# EAGLE schematic 3x7seg-driver (EAGLE 6.5.0)
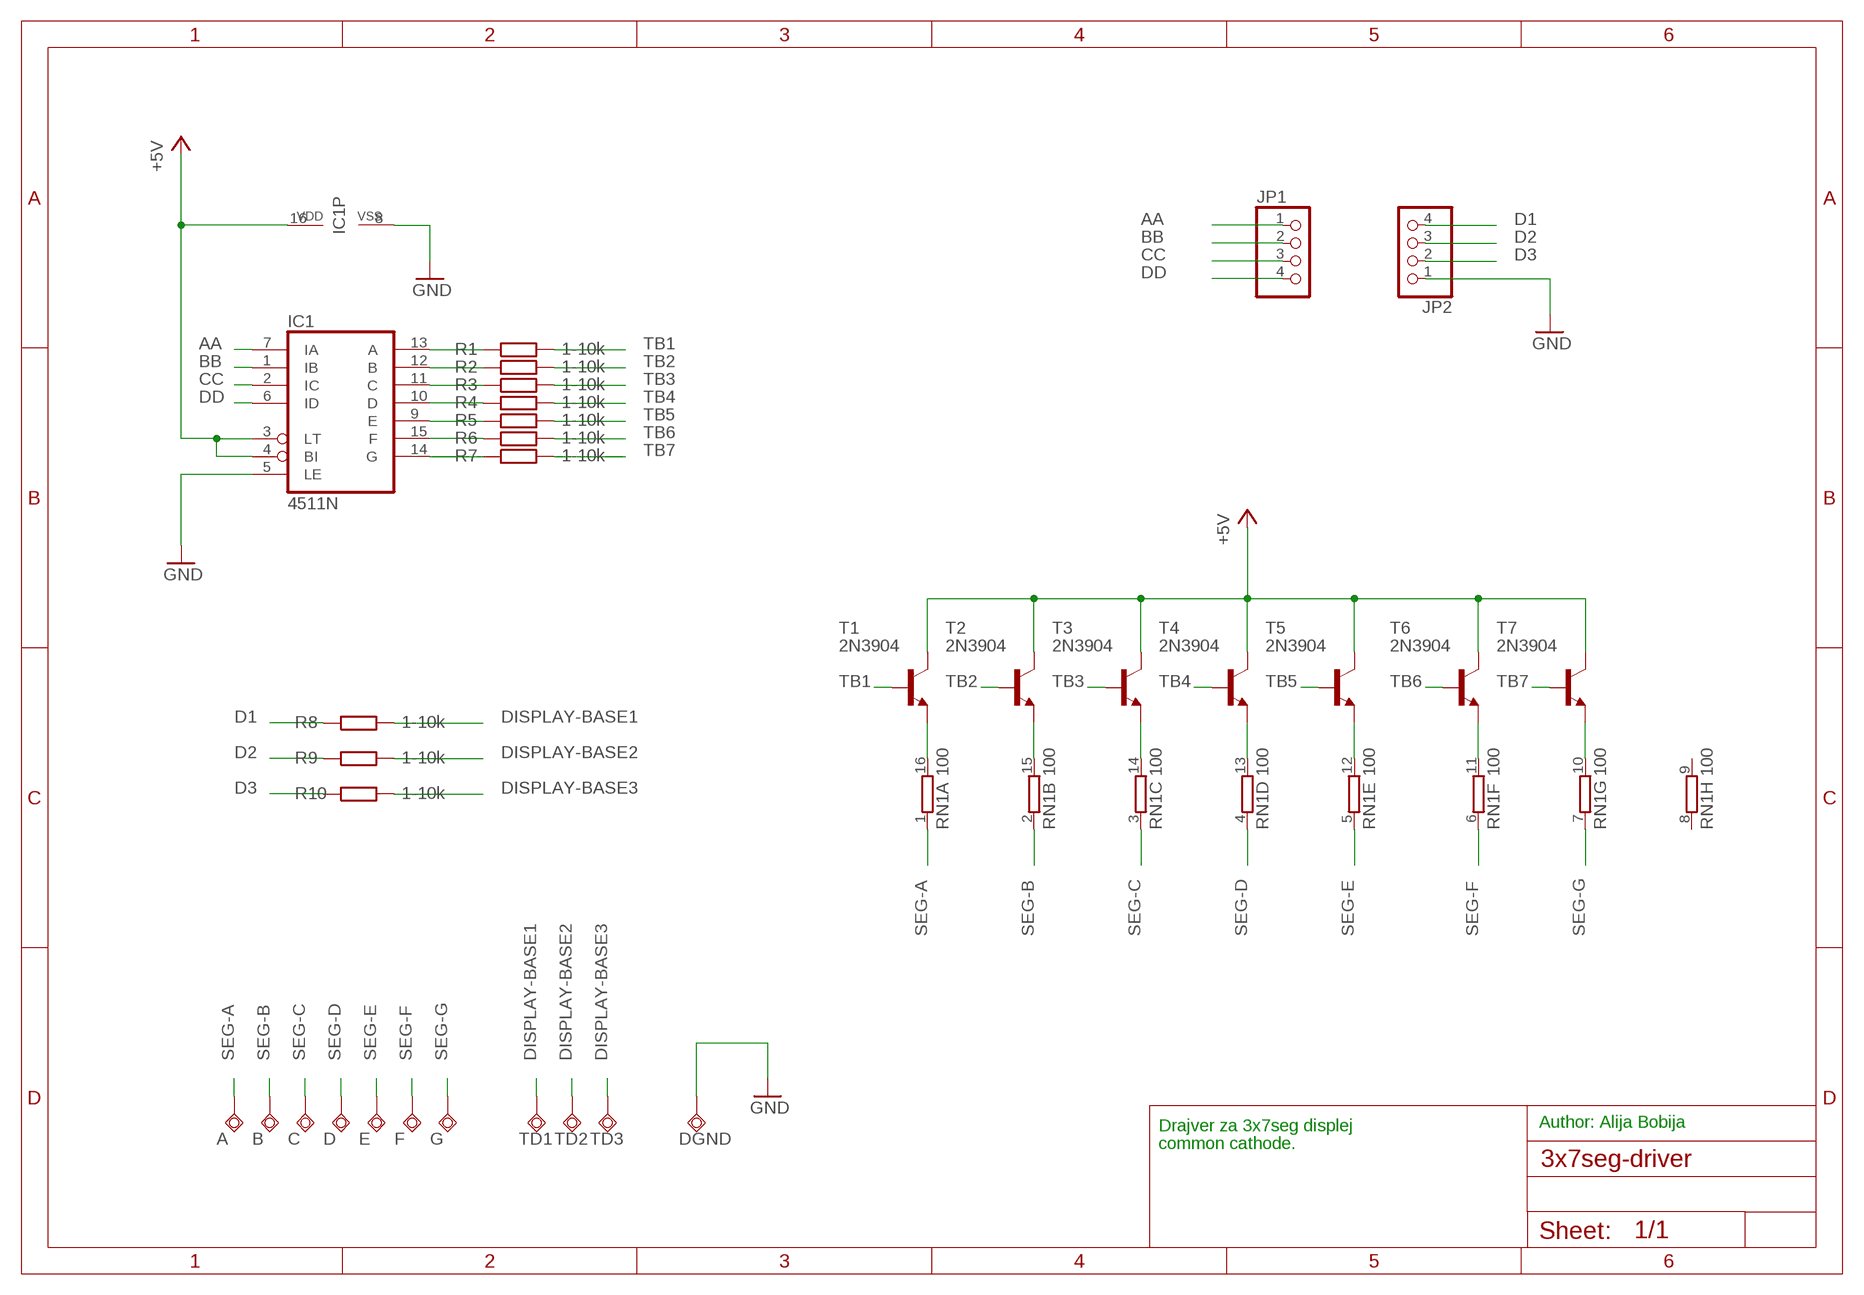
[diagram p0: schematic, sheet 1]

## Parts
A  TPSQTP20SQ  [TP20SQ]
B  TPSQTP20SQ  [TP20SQ]
C  TPSQTP20SQ  [TP20SQ]
D  TPSQTP20SQ  [TP20SQ]
DGND  TPSQTP20SQ  [TP20SQ]
E  TPSQTP20SQ  [TP20SQ]
F  TPSQTP20SQ  [TP20SQ]
G  TPSQTP20SQ  [TP20SQ]
IC1  4511N  [DIL16]
JP1  PINHD-1X4/90  [1X04/90]
JP2  PINHD-1X4/90  [1X04/90]
R1  1-10k  R-EU_0207/7  [0207/7]
R2  1-10k  R-EU_0207/7  [0207/7]
R3  1-10k  R-EU_0207/7  [0207/7]
R4  1-10k  R-EU_0207/7  [0207/7]
R5  1-10k  R-EU_0207/7  [0207/7]
R6  1-10k  R-EU_0207/7  [0207/7]
R7  1-10k  R-EU_0207/7  [0207/7]
R8  1-10k  R-EU_0207/7  [0207/7]
R9  1-10k  R-EU_0207/7  [0207/7]
R10  1-10k  R-EU_0207/7  [0207/7]
RN1  100  8R-N  [DIL16]
T1  2N3904  -NPN-SOT23-EBC  [SOT23-EBC]
T2  2N3904  -NPN-SOT23-EBC  [SOT23-EBC]
T3  2N3904  -NPN-SOT23-EBC  [SOT23-EBC]
T4  2N3904  -NPN-SOT23-EBC  [SOT23-EBC]
T5  2N3904  -NPN-SOT23-EBC  [SOT23-EBC]
T6  2N3904  -NPN-SOT23-EBC  [SOT23-EBC]
T7  2N3904  -NPN-SOT23-EBC  [SOT23-EBC]
TD1  TPSQTP20SQ  [TP20SQ]
TD2  TPSQTP20SQ  [TP20SQ]
TD3  TPSQTP20SQ  [TP20SQ]

## Nets
+5V: IC1.3(LT) IC1.4(BI) IC1.16(VDD) T1.C T2.C T3.C T4.C T5.C T6.C T7.C
AA: IC1.7(IA) JP1.1
BB: IC1.1(IB) JP1.2
CC: IC1.2(IC) JP1.3
D1: JP2.4 R8.1
D2: JP2.3 R9.1
D3: JP2.2 R10.1
DD: IC1.6(ID) JP1.4
DISPLAY-BASE1: R8.2 TD1.TP
DISPLAY-BASE2: R9.2 TD2.TP
DISPLAY-BASE3: R10.2 TD3.TP
GND: DGND.TP IC1.5(LE) IC1.8(VSS) JP2.1
N$1: IC1.13(A) R1.1
N$2: IC1.12(B) R2.1
N$3: IC1.11(C) R3.1
N$4: IC1.10(D) R4.1
N$5: IC1.9(E) R5.1
N$6: IC1.15(F) R6.1
N$7: IC1.14(G) R7.1
N$8: RN1.16 T1.E
N$9: RN1.15 T2.E
N$10: RN1.14 T3.E
N$11: RN1.13 T4.E
N$12: RN1.12 T5.E
N$13: RN1.11 T6.E
N$14: RN1.10 T7.E
SEG-A: A.TP RN1.1
SEG-B: B.TP RN1.2
SEG-C: C.TP RN1.3
SEG-D: D.TP RN1.4
SEG-E: E.TP RN1.5
SEG-F: F.TP RN1.6
SEG-G: G.TP RN1.7
TB1: R1.2 T1.B
TB2: R2.2 T2.B
TB3: R3.2 T3.B
TB4: R4.2 T4.B
TB5: R5.2 T5.B
TB6: R6.2 T6.B
TB7: R7.2 T7.B
Unconnected: RN1.8 RN1.9

## Notes on the sheet
- Drajver za 3x7seg displej | Author: Alija Bobija
- common cathode.

## Library data of the parts
A B C D DGND E F G TD1-TD3 = testpad:TPSQ: Test pad
IC1 = 45xx:4511: BCD to 7-segment LATCH/DECODER/DRIVER
JP1 JP2 = pinhead:PINHD-1X4: PIN HEADER
R1-R10 = rcl:R-EU_: RESISTOR, European symbol
RN1 = resistor-dil:8R-N: DIL RESISTOR; OC_FARNELL: unknown; OC_NEWARK: unknown
T1-T7 = transistor:*-NPN-: NPN Transistror BF959 corrected 2008.03.06